# EAGLE design cerebro (EAGLE 7.4.0)
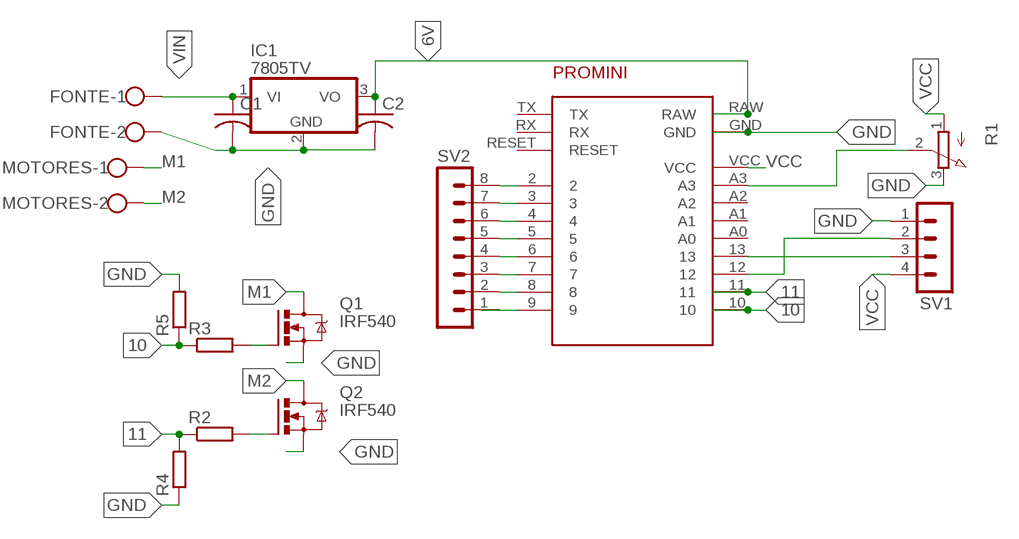
[diagram p0: schematic, sheet 1]

## Parts
C1  C-US025-024X044  [C025-024X044]
C2  C-US025-024X044  [C025-024X044]
FONTE  W237-102  [W237-102]
IC1  7805TV  [TO220V]
MOTORES  W237-102  [W237-102]
Q1  IRF540  [TO220BV]
Q2  IRF540  [TO220BV]
R1  3RP/1610N  [3RP/1610N]
R2  R-EU_0207/10  [0207/10]
R3  R-EU_0207/10  [0207/10]
R4  R-EU_0207/10  [0207/10]
R5  R-EU_0207/10  [0207/10]
SV1  MA04-1  [MA04-1]
SV2  MA08-1  [MA08-1]
U$1  PROMINI  [MICROCONTROLADOR]

## Nets
6V: C2.1 IC1.3(VO) U$1.RAW
10: R3.1 R5.1 U$1.10
11: R2.1 R4.2 U$1.11
GND: C1.2 C2.2 FONTE.2 IC1.2(GND) Q1.S Q2.S R1.3(E) R4.1 R5.2 SV1.1 U$1.GND
M1: MOTORES.1 Q1.D
M2: MOTORES.2 Q2.D
N$1: R1.2(S) U$1.A3
N$2: U$1.9
N$3: Q2.G R2.2
N$4: SV2.2 U$1.8
N$5: SV2.3 U$1.7
N$6: Q1.G R3.2
N$7: SV2.4 U$1.6
N$8: SV2.5 U$1.5
N$9: SV2.6 U$1.4
N$10: SV2.7 U$1.3
N$11: SV2.8 U$1.2
N$12: SV1.2 U$1.12
N$13: SV1.3 U$1.13
VCC: R1.1(A) SV1.4 U$1.VCC
VIN: C1.1 FONTE.1 IC1.1(VI)
Unconnected: SV2.1 U$1.A0 U$1.A1 U$1.A2 U$1.RESET U$1.RX U$1.TX

## Library data of the parts
C1 C2 = rcl:C-US: CAPACITOR, American symbol
FONTE MOTORES = con-wago-500:W237-102: WAGO SCREW CLAMP; MPN: 237-102; OC_FARNELL: unknown; OC_NEWARK: 70K9898
IC1 = linear:78*: Positive VOLTAGE REGULATOR Source: http://cache.national.com/ds/LM/LM78L05.pdf http://www.fairchildsemi.com/ds/LM/LM7805.pdf
Q1 Q2 = transistor-power:IRF540: HEXFET Power MOSFET
R1 = pot:3RP/1610N: 16mm Potentiometer one level Source: http://www.alphapotentiometers.net/html/16mm_pot_2.html
R2-R5 = rcl:R-EU_: RESISTOR, European symbol
SV1 = con-lstb:MA04-1: PIN HEADER; OC_FARNELL: unknown; OC_NEWARK: unknown
SV2 = con-lstb:MA08-1: PIN HEADER; OC_FARNELL: unknown; OC_NEWARK: unknown
U$1 = promini:PROMINI

## Board
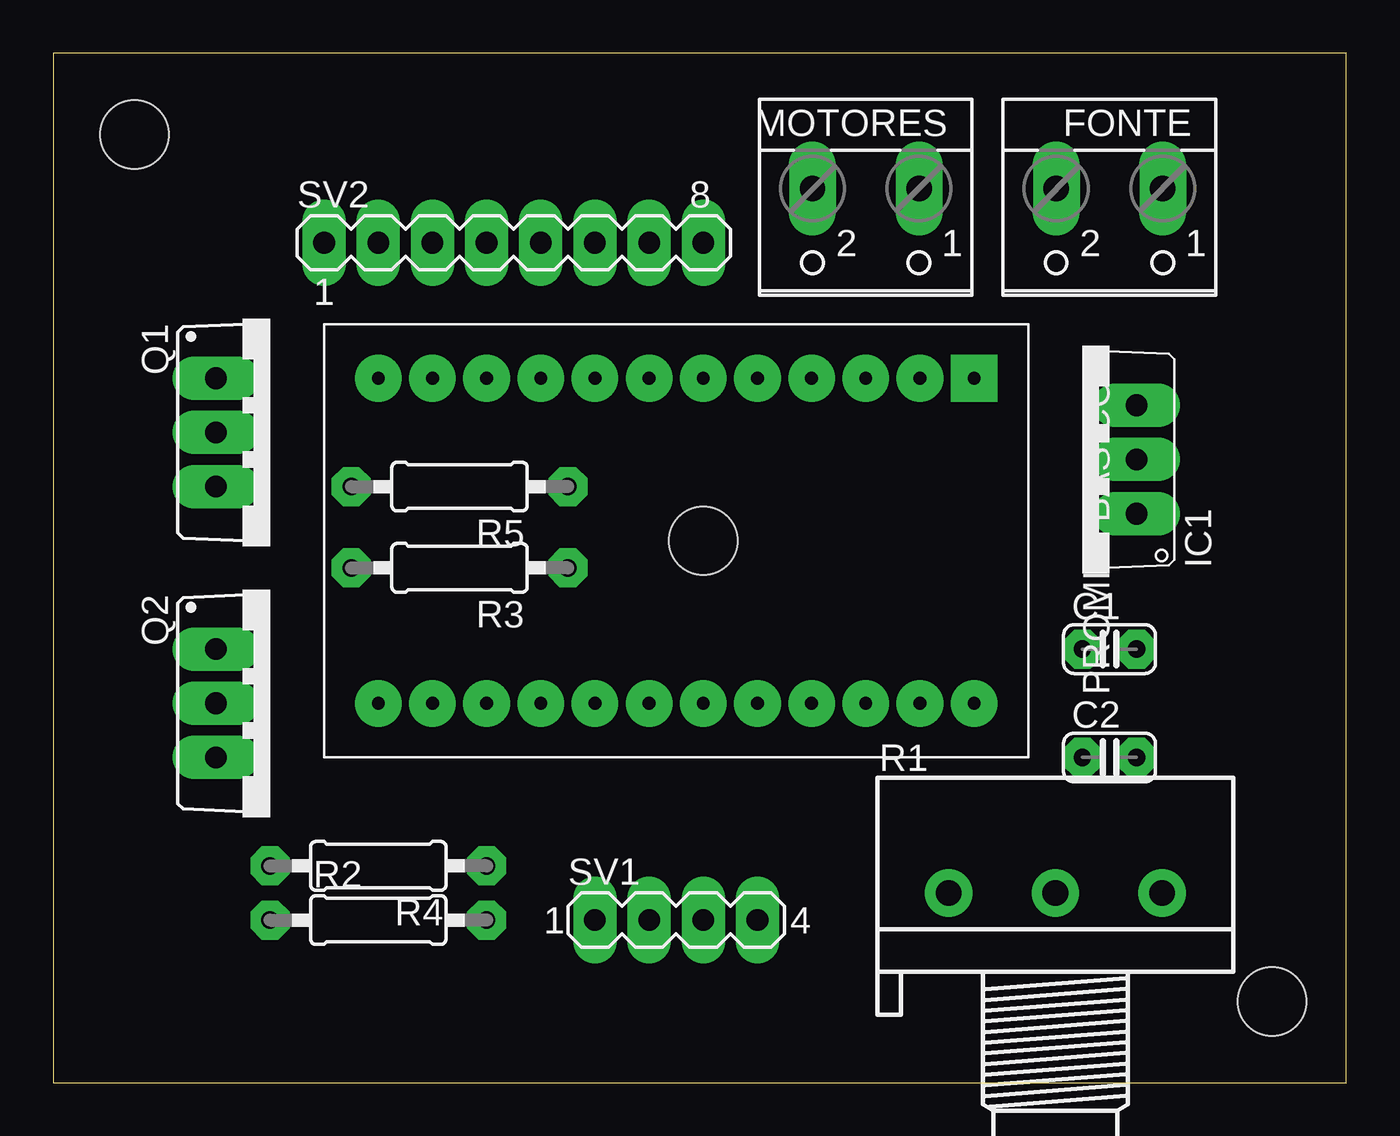
[diagram p1: board, top side]
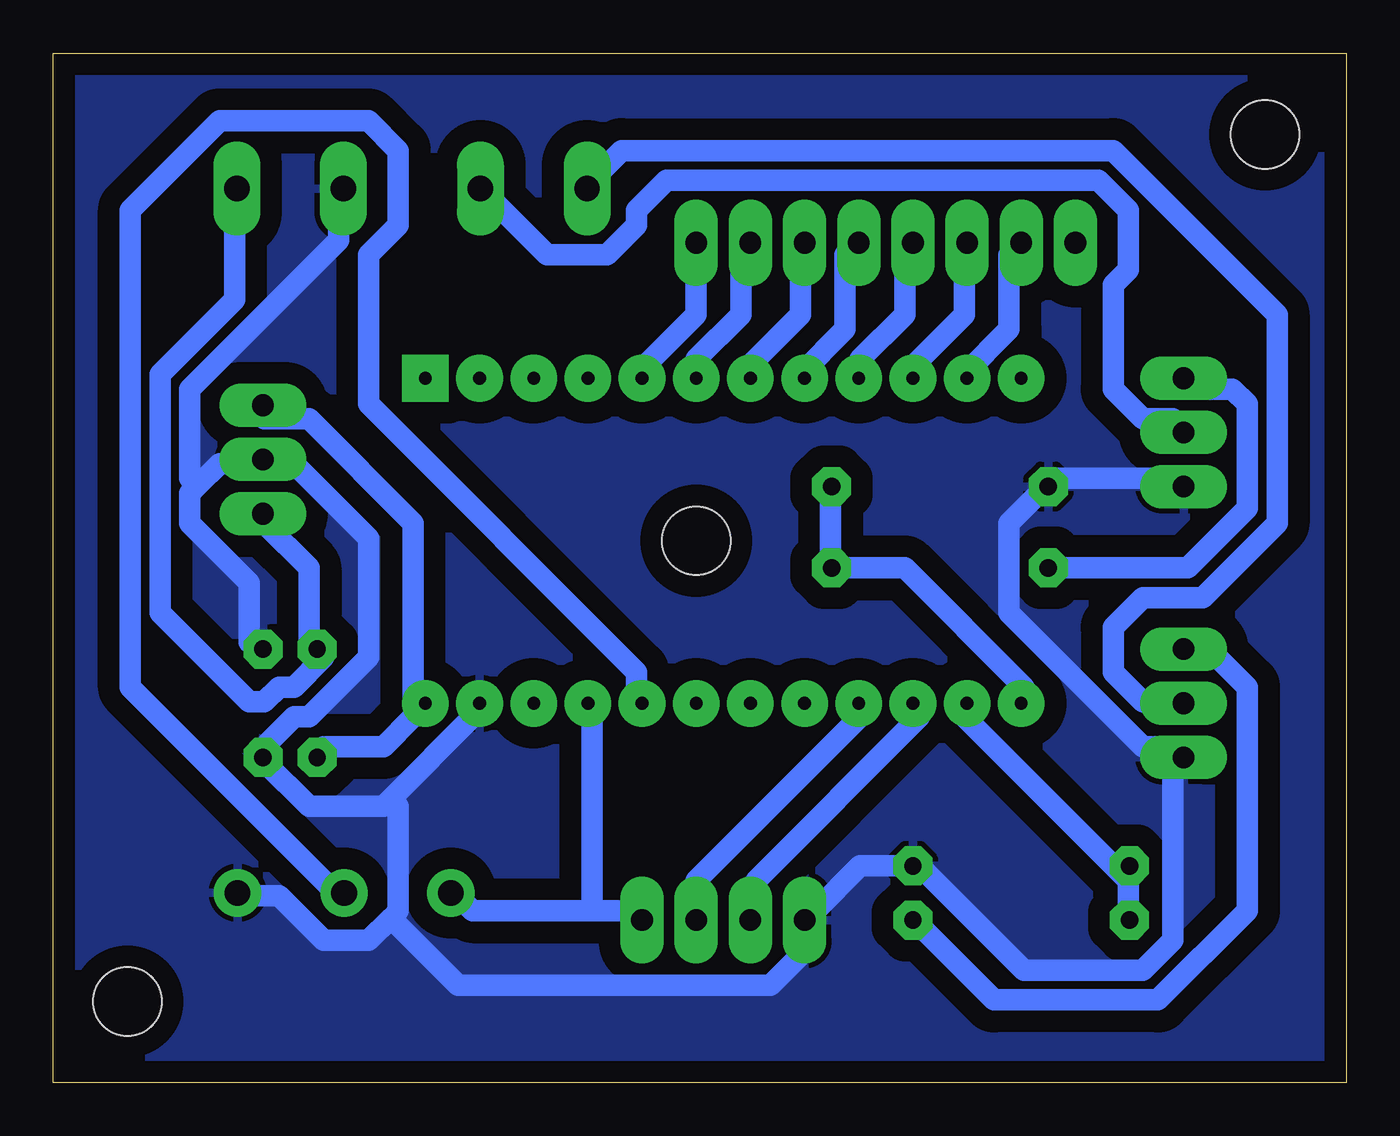
[diagram p2: board, bottom side, seen from below]

Size 60.63 x 48.25 mm. Coordinates in mm from the lower left corner, seen from the top.
Outline: 0,0 60.63,0 60.63,48.25 0,48.25 0,0
Copper layers 16: Bottom 0.035mm
Design rules "default *": minimum track width 40mil, minimum drill 24mil, track to track 15mil, track to pad 15mil, pad to pad 15mil, via to via 15mil, smd to smd 15mil, copper to edge 40mil, drill to drill 15mil, minimum pad ring 20mil, minimum via ring 20mil, stop-mask expansion 4mil, vias tented up to drill 0mil, thermal gap 10mil
Holes 3.2 mm at 30.48,25.4 57.15,3.81 3.81,44.45

### Footprints (pad centres in the part's own frame; a part is rotated, then mirrored left to right if it is on the bottom)
C025-024X044 = drill 0.813 octagon: 1 -1.27,0; 2 1.27,0
W237-102 = drill 1.194 long: 1 -2.5,-1.27; 2 2.5,-1.27
TO220V = drill 1.016 long: 1 -2.54,-2.54; 2 0,-2.54; 3 2.54,-2.54
TO220BV = drill 1.016 long: D 0,-2.54; G -2.54,-2.54; S 2.54,-2.54
3RP/1610N = drill 1.2 pad 2.184: 1 -5,0; 2 0,0; 3 5,0
0207/10 = drill 0.813 octagon: 1 -5.08,0; 2 5.08,0
MA04-1 = drill 1.016 long: 1 -3.81,0; 2 -1.27,0; 3 1.27,0; 4 3.81,0
MA08-1 = drill 1.016 long: 1 -8.89,0; 2 -6.35,0; 3 -3.81,0; 4 -1.27,0; 5 1.27,0; 6 3.81,0; 7 6.35,0; 8 8.89,0
MICROCONTROLADOR = drill 0.6 pad 2.184: 2 12.7,-5.08; 3 15.24,-5.08; 4 17.78,-5.08; 5 20.32,-5.08; 6 22.86,-5.08; 7 25.4,-5.08; 8 27.94,-5.08; 9 30.48,-5.08; 10 30.48,10.16; 11 27.94,10.16; 12 25.4,10.16; 13 22.86,10.16; A0 20.32,10.16; A1 17.78,10.16; A2 15.24,10.16; A3 12.7,10.16; GND 5.08,10.16; RAW 2.54,10.16; RESET 7.62,-5.08; RESET1 10.16,-5.08; RX 5.08,-5.08; VCC 10.16,10.16; VCC1 7.62,10.16 | drill 0.6 pad 2.184 square: TX 2.54,-5.08

### Placement (x,y rotation side)
C1  49.53,20.32 0 top
C2  49.53,15.24 0 top
FONTE  49.53,40.64 180 top
IC1  48.26,29.21 90 top
MOTORES  38.1,40.64 180 top
Q1  10.16,30.48 270 top
Q2  10.16,17.78 270 top
R1  46.99,8.89 0 top
R2  15.24,7.62 0 top
R3  19.05,24.13 180 top
R4  15.24,10.16 180 top
R5  19.05,27.94 180 top
SV1  29.21,7.62 0 top
SV2  21.59,39.37 0 top
U$1  45.72,27.94 180 top

### Tracks (layer width: path | path; a pad name or v marks a point on that pad's centre or on a via)
6V
  Bottom 1.016: C2.1 47.94,15.75 45.15,15.75 43.75,17.14 U$1.RAW 43.75,17.84 43.75,26.23 48.64,31.11 50.74,31.11 IC1.3
10
  Bottom 1.016: R5.1 24.19,27.62 24.19,24.13 R3.1 20.7,24.13 15.11,18.54 15.11,17.84 U$1.10
11
  Bottom 1.016: 10.22,9.46 10.22,10.16 R4.2 10.22,9.46 | 10.22,9.46 10.22,8.06 R2.1 | 10.22,9.46 17.91,17.14 U$1.11
GND
  Bottom 1.016: 53.88,27.97 52.83,29.02 51.44,29.02 IC1.2 50.74,29.02 49.34,29.02 45.85,25.53 45.85,19.94 48.64,17.14 49.34,17.14 50.74,15.75 C2.2 50.74,15.05 48.64,12.95 45.15,12.95 44.8,13.3 | 53.88,27.97 54.23,27.62 54.23,26.23 51.44,23.43 51.44,20.64 C1.2 | FONTE.2 47.24,41.59 47.24,39.5 54.23,32.51 54.23,28.32 53.88,27.97 | Q1.S 8.13,28.32 13.72,28.32 R5.2 14.41,27.62 15.81,26.23 15.81,22.04 9.52,15.75 8.13,15.75 Q2.S 8.13,15.05 8.13,6.67 9.52,5.27 15.11,5.27 20,10.16 R4.1 22.8,10.16 24.89,8.06 SV1.1 25.59,7.37 25.59,5.97 26.99,4.57 41.66,4.57 44.8,7.71 | 44.8,13.3 40.96,17.14 U$1.GND | 44.8,7.71 44.45,8.06 44.45,12.95 44.8,13.3 | 44.8,7.71 45.85,6.67 47.94,6.67 50.04,8.76 51.44,8.76 R1.3
  pour Bottom (isolate 1.016): 0,48.26 0,0 60.96,0 60.96,48.26
M1
  Bottom 1.016: Q1.D 8.13,31.11 9.52,31.11 10.92,32.51 10.92,37.4 10.22,38.1 10.22,40.89 11.62,42.29 31.88,42.29 33.27,40.89 33.27,40.2 34.67,38.8 37.47,38.8 40.26,41.59 MOTORES.1
M2
  Bottom 1.016: Q2.D 8.13,17.84 9.52,17.84 10.92,19.24 10.92,21.34 9.52,22.73 6.73,22.73 3.24,26.23 3.24,36 10.92,43.69 33.97,43.69 35.37,42.29 MOTORES.2
N$1
  Bottom 1.016: U$1.A3 33.27,17.84 33.27,19.24 45.85,31.81 45.85,38.8 44.45,40.2 44.45,43.69 45.85,45.09 52.83,45.09 57.02,40.89 57.02,18.54 47.24,8.76 R1.2
N$3
  Bottom 1.016: R2.2 20,7.37 16.51,3.87 8.83,3.87 4.64,8.06 4.64,18.54 6.03,19.94 7.43,19.94 Q2.G
N$4
  Bottom 1.016: SV2.2 15.81,38.8 15.81,35.31 17.91,33.21 U$1.8
N$5
  Bottom 1.016: SV2.3 17.91,38.8 17.91,36 20.7,33.21 U$1.7
N$6
  Bottom 1.016: R3.2 7.43,24.13 4.64,26.92 4.64,31.81 5.33,32.51 7.43,32.51 Q1.G
N$7
  Bottom 1.016: SV2.4 20.7,38.8 20.7,36 22.8,33.91 22.8,33.21 U$1.6
N$8
  Bottom 1.016: SV2.5 23.49,38.8 23.49,35.31 25.59,33.21 U$1.5
N$9
  Bottom 1.016: SV2.6 25.59,38.8 25.59,36 28.38,33.21 U$1.4
N$10
  Bottom 1.016: U$1.3 30.48,33.91 28.38,36 28.38,38.8 SV2.7
N$11
  Bottom 1.016: SV2.8 30.48,36 33.27,33.21 U$1.2
N$12
  Bottom 1.016: SV1.2 27.69,8.06 27.69,9.46 20,17.14 U$1.12
N$13
  Bottom 1.016: SV1.3 30.48,9.46 22.8,17.14 U$1.13
VCC
  Bottom 1.016: 35.37,8.06 40.96,8.06 41.66,8.76 R1.1 | 35.37,8.06 33.27,8.06 SV1.4 | 35.37,8.06 35.37,17.14 U$1.VCC
VIN
  Bottom 1.016: IC1.1 50.74,26.23 48.64,24.13 48.64,20.64 C1.1 47.94,19.94 49.34,18.54 50.04,18.54 50.74,17.84 51.44,17.84 55.63,22.04 55.63,33.21 52.13,36.7 52.13,41.59 FONTE.1